# Altium schematic sheet vDAC1.SchDoc: Laser PCB
size A3; DrawnBy: James Singleton; Organization: TMC Technology Ltd.; DocumentNumber: 14; Revision: A; SheetNumber: 14; SheetTotal: 18; Drawn Date: 22/12/2020
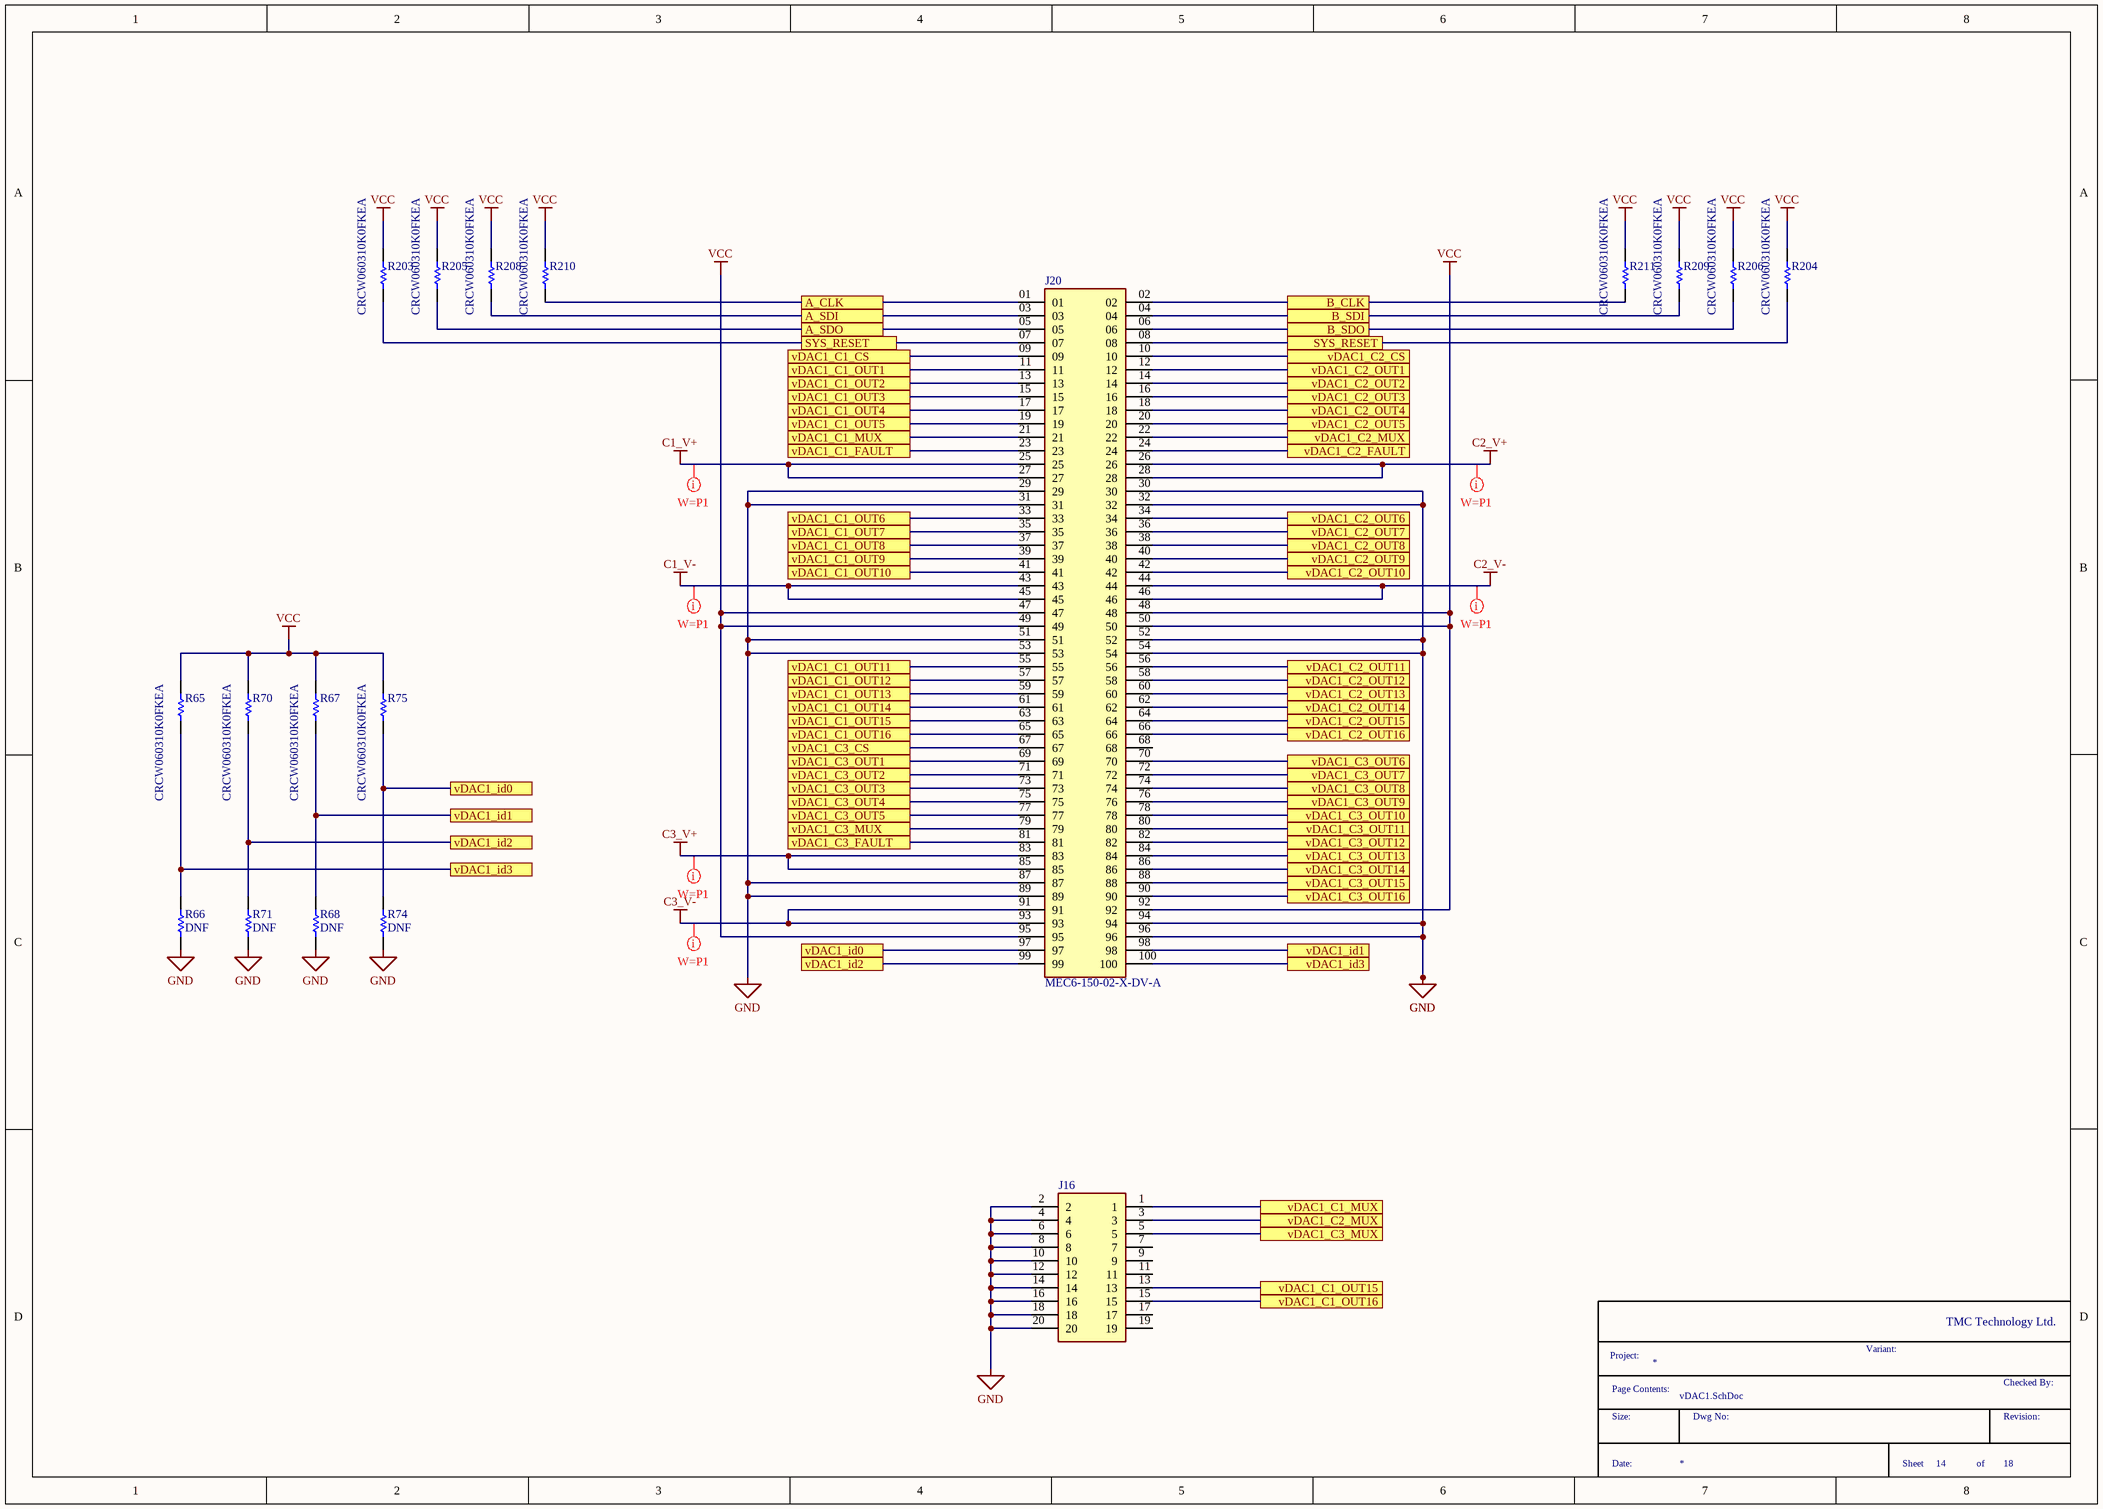
[diagram p0: vDAC1.SchDoc]

## Parts
J16  (no value)  [HDRV20W40P127_2X10_1270X340X550P]
J20  MEC6-150-02-X-DV-A  [SAMTEC_MEC6-150-02-X-DV-A]
R65  CRCW060310K0FKEA  [RESC1609X50X30NL8T20]
R66  DNF  [RESC1609X50X30NL8T20]
R67  CRCW060310K0FKEA  [RESC1609X50X30NL8T20]
R68  DNF  [RESC1609X50X30NL8T20]
R70  CRCW060310K0FKEA  [RESC1609X50X30NL8T20]
R71  DNF  [RESC1609X50X30NL8T20]
R74  DNF  [RESC1609X50X30NL8T20]
R75  CRCW060310K0FKEA  [RESC1609X50X30NL8T20]
R203  CRCW060310K0FKEA  [RESC1609X50X30NL8T20]
R204  CRCW060310K0FKEA  [RESC1609X50X30NL8T20]
R205  CRCW060310K0FKEA  [RESC1609X50X30NL8T20]
R206  CRCW060310K0FKEA  [RESC1609X50X30NL8T20]
R208  CRCW060310K0FKEA  [RESC1609X50X30NL8T20]
R209  CRCW060310K0FKEA  [RESC1609X50X30NL8T20]
R210  CRCW060310K0FKEA  [RESC1609X50X30NL8T20]
R211  CRCW060310K0FKEA  [RESC1609X50X30NL8T20]

## Ports
A_CLK (see iDAC1[4A], iDAC2[4A], PI_INTERFACE[2B], vDAC2[4A]), A_SDI (see iDAC1[4A], iDAC2[4A], PI_INTERFACE[2B], vDAC2[4A]), A_SDO (see iDAC1[4A], iDAC2[4A], PI_INTERFACE[1B], vDAC2[4A]), B_CLK (see iDAC1[6A], iDAC2[6A], PI_INTERFACE[2B], vDAC2[5A]), B_SDI (see iDAC1[6A], iDAC2[6A], PI_INTERFACE[2B], vDAC2[5A]), B_SDO (see iDAC1[6A], iDAC2[6A], PI_INTERFACE[1B], vDAC2[5A]), SYS_RESET (see iDAC1[4A], iDAC1[6A], iDAC2[4A], iDAC2[6A], PI_INTERFACE[1C], PIO[5A], PIO[5D], PIO[7B], PIO[7C], vDAC1[4A], vDAC2[3A], vDAC2[5A]), SYS_RESET (see iDAC1[4A], iDAC1[6A], iDAC2[4A], iDAC2[6A], PI_INTERFACE[1C], PIO[5A], PIO[5D], PIO[7B], PIO[7C], vDAC1[5A], vDAC2[3A], vDAC2[5A]), vDAC1_C1_CS (see ChipSelects+Faults[6A]), vDAC1_C1_FAULT (see ChipSelects+Faults[4A]), vDAC1_C1_MUX (see vDAC1[3B]), vDAC1_C1_MUX (see vDAC1[5D]), vDAC1_C1_OUT1 (see TX_FlexiConnectors[3A]), vDAC1_C1_OUT2 (see TX_FlexiConnectors[3A]), vDAC1_C1_OUT3 (see TX_FlexiConnectors[3A]), vDAC1_C1_OUT4 (see TX_FlexiConnectors[3B]), vDAC1_C1_OUT5 (see TX_FlexiConnectors[3B]), vDAC1_C1_OUT6 (see TX_FlexiConnectors[3B]), vDAC1_C1_OUT7 (see TX_FlexiConnectors[3B]), vDAC1_C1_OUT8 (see TX_FlexiConnectors[3B]), vDAC1_C1_OUT9 (see TX_FlexiConnectors[3B]), vDAC1_C1_OUT10 (see TX_FlexiConnectors[3B]), vDAC1_C1_OUT11 (see TX_FlexiConnectors[3B]), vDAC1_C1_OUT12 (see TX_FlexiConnectors[3B]), vDAC1_C1_OUT13 (see TX_FlexiConnectors[3B]), vDAC1_C1_OUT14 (see TX_FlexiConnectors[3B]), vDAC1_C1_OUT15 (see TX_FlexiConnectors[3B], vDAC1[3B]), vDAC1_C1_OUT15 (see TX_FlexiConnectors[3B], vDAC1[5D]), vDAC1_C1_OUT16 (see TX_FlexiConnectors[1B], vDAC1[3B]), vDAC1_C1_OUT16 (see TX_FlexiConnectors[1B], vDAC1[5D]), vDAC1_C2_CS (see ChipSelects+Faults[6A]), vDAC1_C2_FAULT (see ChipSelects+Faults[1A]), vDAC1_C2_MUX (see vDAC1[5B]), vDAC1_C2_MUX (see vDAC1[5D]), vDAC1_C2_OUT1 (see TX_FlexiConnectors[3B]), vDAC1_C2_OUT2 (see TX_FlexiConnectors[3B]), vDAC1_C2_OUT3 (see TX_FlexiConnectors[3B]), vDAC1_C2_OUT4 (see TX_FlexiConnectors[3B]), vDAC1_C2_OUT5 (see TX_FlexiConnectors[3C]), vDAC1_C2_OUT6 (see TX_FlexiConnectors[1C]), vDAC1_C2_OUT7 (see TX_FlexiConnectors[1C]), vDAC1_C2_OUT8 (see TX_FlexiConnectors[1C]), vDAC1_C2_OUT9 (see TX_FlexiConnectors[1C]), vDAC1_C2_OUT10 (see TX_FlexiConnectors[1C]), vDAC1_C2_OUT11 (see TX_FlexiConnectors[1C]), vDAC1_C2_OUT12 (see TX_FlexiConnectors[1C]), vDAC1_C2_OUT13 (see TX_FlexiConnectors[1C]), vDAC1_C2_OUT14 (see TX_FlexiConnectors[1C]), vDAC1_C2_OUT15 (see TX_FlexiConnectors[1C]), vDAC1_C2_OUT16 (see TX_FlexiConnectors[1C]), vDAC1_C3_CS (see ChipSelects+Faults[6A]), vDAC1_C3_FAULT (see ChipSelects+Faults[1A]), vDAC1_C3_MUX (see vDAC1[3C]), vDAC1_C3_MUX (see vDAC1[5D]), vDAC1_C3_OUT1 (see TX_FlexiConnectors[1B]), vDAC1_C3_OUT2 (see TX_FlexiConnectors[1B]), vDAC1_C3_OUT3 (see TX_FlexiConnectors[1B]), vDAC1_C3_OUT4 (see TX_FlexiConnectors[1B]), vDAC1_C3_OUT5 (see TX_FlexiConnectors[1B]), vDAC1_C3_OUT6 (see TX_FlexiConnectors[1B]), vDAC1_C3_OUT7 (see TX_FlexiConnectors[2A]), vDAC1_C3_OUT8 (see TX_FlexiConnectors[2B]), vDAC1_C3_OUT9 (see TX_FlexiConnectors[5C]), vDAC1_C3_OUT10 (see TX_FlexiConnectors[5C]), vDAC1_C3_OUT11 (see TX_FlexiConnectors[5C]), vDAC1_C3_OUT12 (see TX_FlexiConnectors[5C]), vDAC1_C3_OUT13 (see TX_FlexiConnectors[5C]), vDAC1_C3_OUT14 (see TX_FlexiConnectors[5C]), vDAC1_C3_OUT15 (see TX_FlexiConnectors[5C]), vDAC1_C3_OUT16 (see TX_FlexiConnectors[5C]), vDAC1_id0 (see ChipSelects+Faults[1C], vDAC1[2C]), vDAC1_id0 (see ChipSelects+Faults[1C], vDAC1[4C]), vDAC1_id1 (see vDAC1[2C]), vDAC1_id1 (see vDAC1[5C]), vDAC1_id2 (see vDAC1[2C]), vDAC1_id2 (see vDAC1[4C]), vDAC1_id3 (see vDAC1[2C]), vDAC1_id3 (see vDAC1[5C])

## Nets
C1_V+: J20.25 J20.27
C1_V-: J20.43 J20.45
C2_V+: J20.26 J20.28
C2_V-: J20.44 J20.46
C3_V+: J20.83 J20.85
C3_V-: J20.91 J20.93
GND: J16.2 J16.4 J16.6 J16.8 J16.10 J16.12 J16.14 J16.16 J16.18 J16.20 J20.29 J20.30 J20.31 J20.32 J20.51 J20.52 J20.53 J20.54 J20.87 J20.89 J20.94 J20.96 R66.1 R68.1 R71.1 R74.1
VCC: J20.47 J20.48 J20.49 J20.50 J20.92 J20.95 R65.2 R67.2 R70.2 R75.2 R203.2 R204.2 R205.2 R206.2 R208.2 R209.2 R210.2 R211.2
A_CLK: J20.01 R210.1 ; port A_CLK
A_SDI: J20.03 R208.1 ; port A_SDI
A_SDO: J20.05 R205.1 ; port A_SDO
B_CLK: J20.02 R211.1 ; port B_CLK
B_SDI: J20.04 R209.1 ; port B_SDI
B_SDO: J20.06 R206.1 ; port B_SDO
SYS_RESET: J20.07 J20.08 R203.1 R204.1 ; port SYS_RESET
vDAC1_C1_CS: J20.09 ; port vDAC1_C1_CS
vDAC1_C1_FAULT: J20.23 ; port vDAC1_C1_FAULT
vDAC1_C1_MUX: J16.1 J20.21 ; port vDAC1_C1_MUX
vDAC1_C1_OUT1: J20.11 ; port vDAC1_C1_OUT1
vDAC1_C1_OUT2: J20.13 ; port vDAC1_C1_OUT2
vDAC1_C1_OUT3: J20.15 ; port vDAC1_C1_OUT3
vDAC1_C1_OUT4: J20.17 ; port vDAC1_C1_OUT4
vDAC1_C1_OUT5: J20.19 ; port vDAC1_C1_OUT5
vDAC1_C1_OUT6: J20.33 ; port vDAC1_C1_OUT6
vDAC1_C1_OUT7: J20.35 ; port vDAC1_C1_OUT7
vDAC1_C1_OUT8: J20.37 ; port vDAC1_C1_OUT8
vDAC1_C1_OUT9: J20.39 ; port vDAC1_C1_OUT9
vDAC1_C1_OUT10: J20.41 ; port vDAC1_C1_OUT10
vDAC1_C1_OUT11: J20.55 ; port vDAC1_C1_OUT11
vDAC1_C1_OUT12: J20.57 ; port vDAC1_C1_OUT12
vDAC1_C1_OUT13: J20.59 ; port vDAC1_C1_OUT13
vDAC1_C1_OUT14: J20.61 ; port vDAC1_C1_OUT14
vDAC1_C1_OUT15: J16.13 J20.63 ; port vDAC1_C1_OUT15
vDAC1_C1_OUT16: J16.15 J20.65 ; port vDAC1_C1_OUT16
vDAC1_C2_CS: J20.10 ; port vDAC1_C2_CS
vDAC1_C2_FAULT: J20.24 ; port vDAC1_C2_FAULT
vDAC1_C2_MUX: J16.3 J20.22 ; port vDAC1_C2_MUX
vDAC1_C2_OUT1: J20.12 ; port vDAC1_C2_OUT1
vDAC1_C2_OUT2: J20.14 ; port vDAC1_C2_OUT2
vDAC1_C2_OUT3: J20.16 ; port vDAC1_C2_OUT3
vDAC1_C2_OUT4: J20.18 ; port vDAC1_C2_OUT4
vDAC1_C2_OUT5: J20.20 ; port vDAC1_C2_OUT5
vDAC1_C2_OUT6: J20.34 ; port vDAC1_C2_OUT6
vDAC1_C2_OUT7: J20.36 ; port vDAC1_C2_OUT7
vDAC1_C2_OUT8: J20.38 ; port vDAC1_C2_OUT8
vDAC1_C2_OUT9: J20.40 ; port vDAC1_C2_OUT9
vDAC1_C2_OUT10: J20.42 ; port vDAC1_C2_OUT10
vDAC1_C2_OUT11: J20.56 ; port vDAC1_C2_OUT11
vDAC1_C2_OUT12: J20.58 ; port vDAC1_C2_OUT12
vDAC1_C2_OUT13: J20.60 ; port vDAC1_C2_OUT13
vDAC1_C2_OUT14: J20.62 ; port vDAC1_C2_OUT14
vDAC1_C2_OUT15: J20.64 ; port vDAC1_C2_OUT15
vDAC1_C2_OUT16: J20.66 ; port vDAC1_C2_OUT16
vDAC1_C3_CS: J20.67 ; port vDAC1_C3_CS
vDAC1_C3_FAULT: J20.81 ; port vDAC1_C3_FAULT
vDAC1_C3_MUX: J16.5 J20.79 ; port vDAC1_C3_MUX
vDAC1_C3_OUT1: J20.69 ; port vDAC1_C3_OUT1
vDAC1_C3_OUT2: J20.71 ; port vDAC1_C3_OUT2
vDAC1_C3_OUT3: J20.73 ; port vDAC1_C3_OUT3
vDAC1_C3_OUT4: J20.75 ; port vDAC1_C3_OUT4
vDAC1_C3_OUT5: J20.77 ; port vDAC1_C3_OUT5
vDAC1_C3_OUT6: J20.70 ; port vDAC1_C3_OUT6
vDAC1_C3_OUT7: J20.72 ; port vDAC1_C3_OUT7
vDAC1_C3_OUT8: J20.74 ; port vDAC1_C3_OUT8
vDAC1_C3_OUT9: J20.76 ; port vDAC1_C3_OUT9
vDAC1_C3_OUT10: J20.78 ; port vDAC1_C3_OUT10
vDAC1_C3_OUT11: J20.80 ; port vDAC1_C3_OUT11
vDAC1_C3_OUT12: J20.82 ; port vDAC1_C3_OUT12
vDAC1_C3_OUT13: J20.84 ; port vDAC1_C3_OUT13
vDAC1_C3_OUT14: J20.86 ; port vDAC1_C3_OUT14
vDAC1_C3_OUT15: J20.88 ; port vDAC1_C3_OUT15
vDAC1_C3_OUT16: J20.90 ; port vDAC1_C3_OUT16
vDAC1_id0: J20.97 R74.2 R75.1 ; port vDAC1_id0
vDAC1_id1: J20.98 R67.1 R68.2 ; port vDAC1_id1
vDAC1_id2: J20.99 R70.1 R71.2 ; port vDAC1_id2
vDAC1_id3: J20.100 R65.1 R66.2 ; port vDAC1_id3

Not connected (* = marked no-connect by the designer): J16 7 9 11 17 19; J20 68

## Layout directives
mark named W=P1: C1_V+, C1_V-, C2_V+, C2_V-, C3_V+, C3_V-

## Notes on the sheet
- TMC Technology Ltd.
- Page Contents:
- Project:
- Variant:
- Checked By:
- Size:
- Date:
- Dwg No:
- Sheet
- of
- Revision:

## Library data of the parts
J16 = 20021111-00020T4LF: Connector; Manufacturer_Name: FCI Electronics; Datasheet Link: https://media.digikey.com/pdf/Data%20Sheets/FCI%20PDFs/Minitek%20127_Catalog.pdf; Height: 5.5mm; Manufacturer_Part_Number: 20021111-00020T4LF
J20 = MEC6-150-02-X-DV-A: MF: Samtec; System: Connector; MP: MEC6-150-02-X-DV-A; Package: None; Availability: Unavailable; Value: *; Price: None
R65 R67 R70 R75 R203-R206 R208-R211 = CMP-1666-00005-4: Chip Resistor, 10 KOhm, +/- 1%, 100 mW, -55 to 155 degC, 0603 (1608 Metric), RoHS, Tape and Reel; Manufacturer: Vishay; Voltage Rating: 75 V; Max Operating Temperature: 155 degC; PackageDescription: 2-Pin Surface Mount Device, Body 1.575 x 0.85 mm; ComponentLink1Description: Manufacturer URL; RoHSCompliant: true; PackageReference: 0603; REACH SVHC: Unknown; Length: 1.55 mm; DatasheetVersion: 06/2012; Packaging: Tape and Reel; Min Operating Temperature: -55 degC; Mounting Technology: Surface Mount; ComponentLink2URL: https://datasheet.ciiva.com/11809/0900766b80d98afc-11809037.pdf; Height: 0.45 mm; ComponentLink2Description: Datasheet; Package Quantity: 5000; ComponentLink1URL: http://www.vishay.com/; Manufacturer Part Number: CRCW060310K0FKEA
R66 R68 R71 R74 = CMP-2000-03816-5: Chip Resistor, 0 Ohm, Jumper, 100 mW, -55 to 155 degC, 0603 (1608 Metric), RoHS, Tape and Reel; Manufacturer: Vishay; Manufacturer Part Number: CRCW0603-0000Z0EA; Voltage Rating: 75 V; Package Quantity: 5000; DatasheetVersion: 06/2012; Min Operating Temperature: -55 degC; ComponentLink1URL: http://www.vishay.com/; Mounting Technology: Surface Mount; Height: 0.45 mm; ComponentLink1Description: Manufacturer URL; REACH SVHC: Unknown; PackageReference: 0603; Packaging: Tape and Reel; Max Operating Temperature: 155 degC; Mount: Surface Mount; ComponentLink2Description: Datasheet; PackageDescription: 2-Pin Surface Mount Device, Body 1.575 x 0.85 mm; Length: 1.55 mm; ComponentLink2URL: http://www.vishay.com/docs/20035/dcrcwe3.pdf; Pins: 2; RoHSCompliant: true